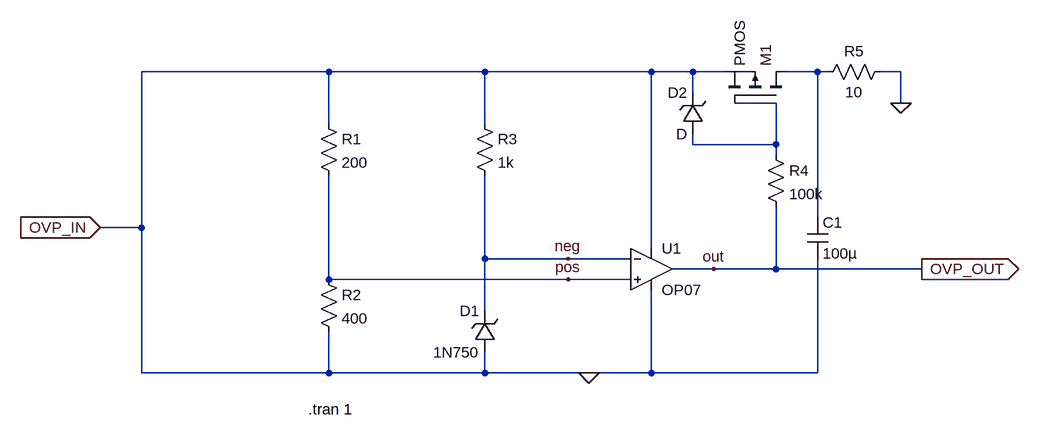
[diagram p0: schematic OVP.asc]
OVP.asc, the LTspice schematic file:
Version 4
SHEET 1 1208 680
WIRE 144 96 -144 96
WIRE 384 96 144 96
WIRE 640 96 384 96
WIRE 704 96 640 96
WIRE 752 96 704 96
WIRE 896 96 848 96
WIRE 912 96 896 96
WIRE 1024 96 992 96
WIRE 704 128 704 96
WIRE 832 144 768 144
WIRE 1024 144 1024 96
WIRE 144 176 144 96
WIRE 384 176 384 96
WIRE 704 208 704 192
WIRE 832 208 832 144
WIRE 832 208 704 208
WIRE 832 224 832 208
WIRE 896 320 896 96
WIRE -144 336 -144 96
WIRE -144 336 -208 336
WIRE 640 368 640 96
WIRE 384 384 384 256
WIRE 512 384 384 384
WIRE 608 384 512 384
WIRE 736 400 672 400
WIRE 832 400 832 304
WIRE 832 400 736 400
WIRE 1056 400 832 400
WIRE 144 416 144 256
WIRE 512 416 144 416
WIRE 608 416 512 416
WIRE 384 464 384 384
WIRE -144 560 -144 336
WIRE 144 560 144 496
WIRE 144 560 -144 560
WIRE 384 560 384 528
WIRE 384 560 144 560
WIRE 544 560 384 560
WIRE 640 560 640 432
WIRE 640 560 544 560
WIRE 896 560 896 384
WIRE 896 560 640 560
FLAG 1024 144 0
FLAG 544 560 0
FLAG 512 384 neg
FLAG 512 416 pos
FLAG 736 400 out
FLAG -208 336 OVP_IN
IOPIN -208 336 In
FLAG 1056 400 OVP_OUT
IOPIN 1056 400 Out
SYMBOL Res 128 160 R0
SYMATTR InstName R1
SYMATTR Value 200
SYMBOL Res 128 400 R0
SYMATTR InstName R2
SYMATTR Value 400
SYMBOL Res 368 160 R0
SYMATTR InstName R3
SYMATTR Value 1k
SYMBOL OpAmps/OP07 640 336 R0
SYMATTR InstName U1
SYMBOL zener 400 528 R180
WINDOW 0 24 64 Left 2
WINDOW 3 24 0 Left 2
SYMATTR InstName D1
SYMATTR Value 1N750
SYMBOL Res 816 208 R0
SYMATTR InstName R4
SYMATTR Value 100k
SYMBOL pmos 848 144 M270
SYMATTR InstName M1
SYMBOL zener 720 192 R180
WINDOW 0 24 64 Left 2
WINDOW 3 24 0 Left 2
SYMATTR InstName D2
SYMBOL Res 1008 80 R90
WINDOW 0 0 56 VBottom 2
WINDOW 3 32 56 VTop 2
SYMATTR InstName R5
SYMATTR Value 10
SYMBOL cap 880 320 R0
SYMATTR InstName C1
SYMATTR Value 100µ
TEXT 112 616 Left 2 !.tran 1

The netlist it stands for:
* OVP.asc
R1 0 pos 200
R2 pos 0 400
R3 0 neg 1k
XU1 pos neg 0 0 OVP_OUT LT1001  ; OP07, pins In+ In- V+ V- OUT
D1 0 neg 1N750
R4 N002 OVP_OUT 100k
M1 N001 N002 0 0 PMOS
D2 N002 0 D
R5 0 N001 10
C1 N001 0 100µ
.model D D
.lib standard.dio
.model NMOS NMOS
.model PMOS PMOS
.lib standard.mos
.tran 1
.lib LTC.lib
.backanno
.end